# EAGLE design Noise-Source-Stereo (EAGLE 7.2.0)
Random Number Generation with a Simple Transistor Junction Noise Source (Version 1 Revision 2. 22 June 2004) https://imotp.sourceforge.net/noise.pdf
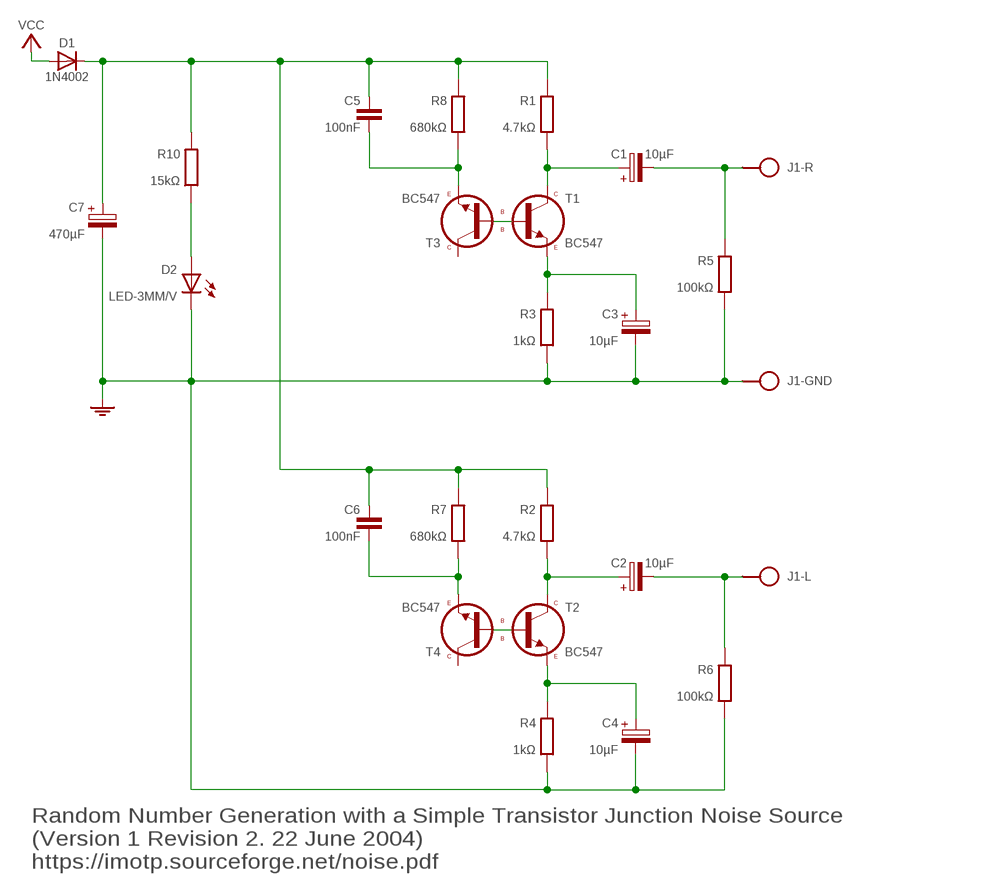
[diagram p0: schematic, sheet 1]

## Parts
C1  10µF  CPOL-HE2,5-5  [E2,5-5]
C2  10µF  CPOL-HE2,5-5  [E2,5-5]
C3  10µF  CPOLE2,5-4/V  [E2.5-4/V]
C4  10µF  CPOLE2,5-4/V  [E2.5-4/V]
C5  100nF  C050-025X075/V  [C050-025X075/V]
C6  100nF  C050-025X075/V  [C050-025X075/V]
C7  470µF  CPOLE5-5/V  [E5-5/V]
D1  1N4002  DIODE-HDO34-7  [DO34-7]
D2  LED-3MM/V  [LED_3MM/V]
GND  VCC_GNDL  [SPAD-+]
J1  SAUDIOR-GND-L  [SPAD-R-GND-L]
R1  4.7kΩ  R0204/10-V  [0204/10-V]
R2  4.7kΩ  R0204/10-V  [0204/10-V]
R3  1kΩ  R0204/10-V  [0204/10-V]
R4  1kΩ  R0204/10  [0204/10]
R5  100kΩ  R0204/10-V  [0204/10-V]
R6  100kΩ  R0204/10-V  [0204/10-V]
R7  680kΩ  R0204/10-V  [0204/10-V]
R8  680kΩ  R0204/10-V  [0204/10-V]
R10  15kΩ  R0204/10-V  [0204/10-V]
T1  BC547  [TO92]
T2  BC547  [TO92]
T3  BC547  [TO92]
T4  BC547  [TO92]

## Nets
GND: C3.- C4.- C7.- D2.K(C) GND.1 J1.0 R3.2 R4.2 R5.2 R6.2
N$1: C2.+ R2.2 T2.1(C)
N$2: C4.+ R4.1 T2.3(E)
N$4: C3.+ R3.1 T1.3(E)
N$6: C1.+ R1.2 T1.1(C)
N$7: T1.2(B) T3.2(B)
N$8: C5.2 R8.2 T3.3(E)
N$9: T2.2(B) T4.2(B)
N$10: D2.A R10.2
N$11: C6.2 R7.2 T4.3(E)
N$12: C2.- J1.L R6.1
N$15: C1.- J1.R R5.1
VCC: D1.A GND.2
VCC2: C5.1 C6.1 C7.+ D1.C R1.1 R2.1 R7.1 R8.1 R10.1
Unconnected: T3.1(C) T4.1(C)

## Notes on the sheet
- Random Number Generation with a Simple Transistor Junction Noise Source
  (Version 1 Revision 2. 22 June 2004)
  https://imotp.sourceforge.net/noise.pdf

## Library data of the parts
C1 C2 = c:CPOL-H
C3 C4 C7 = c:CPOL: POLARIZED CAPACITOR, European symbol
C5 C6 = c:C: CAPACITOR, European symbol
D1 = d:DIODE-H
D2 = d:LED
GND = pad:VCC_GND
J1 = pad:SAUDIO
R1-R8 R10 = r:R: RESISTOR, European symbol
T1-T4 = t:BC547

## Net classes
0 default: clearance 0.254 mm

## Board
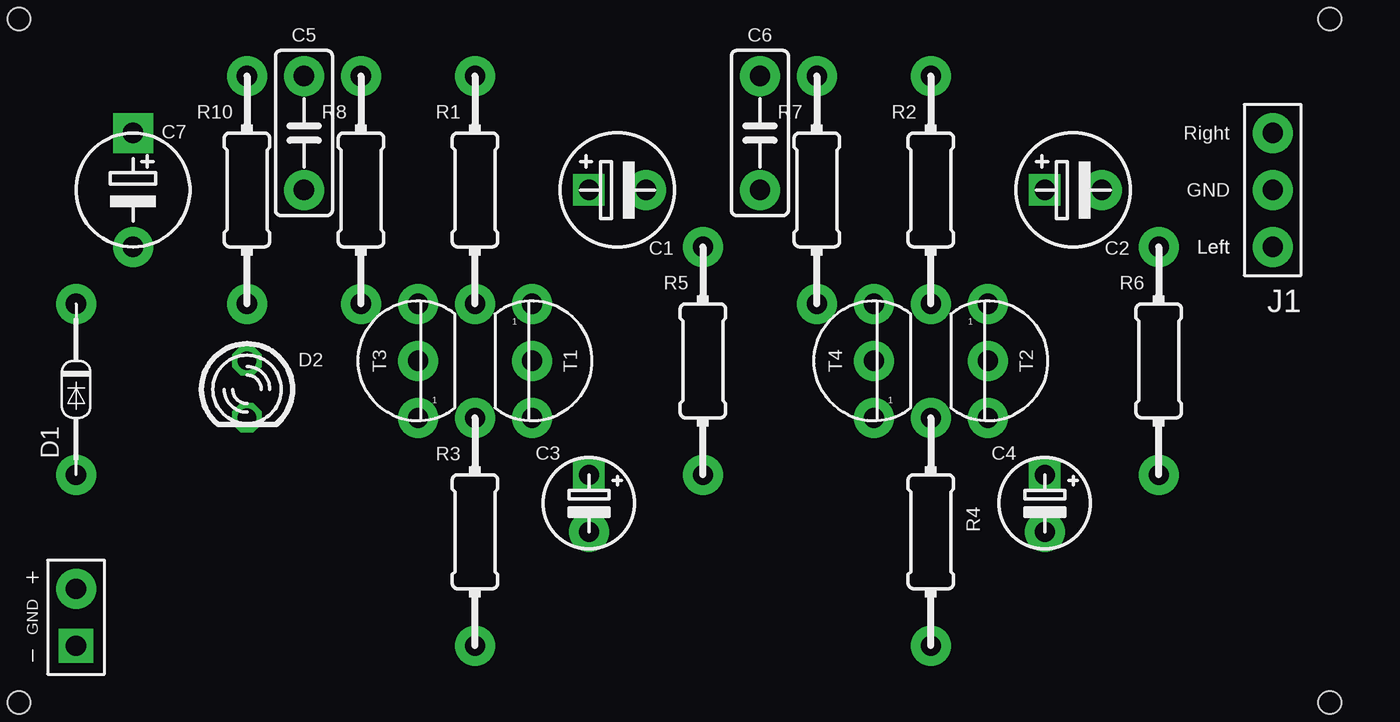
[diagram p1: board, top side]
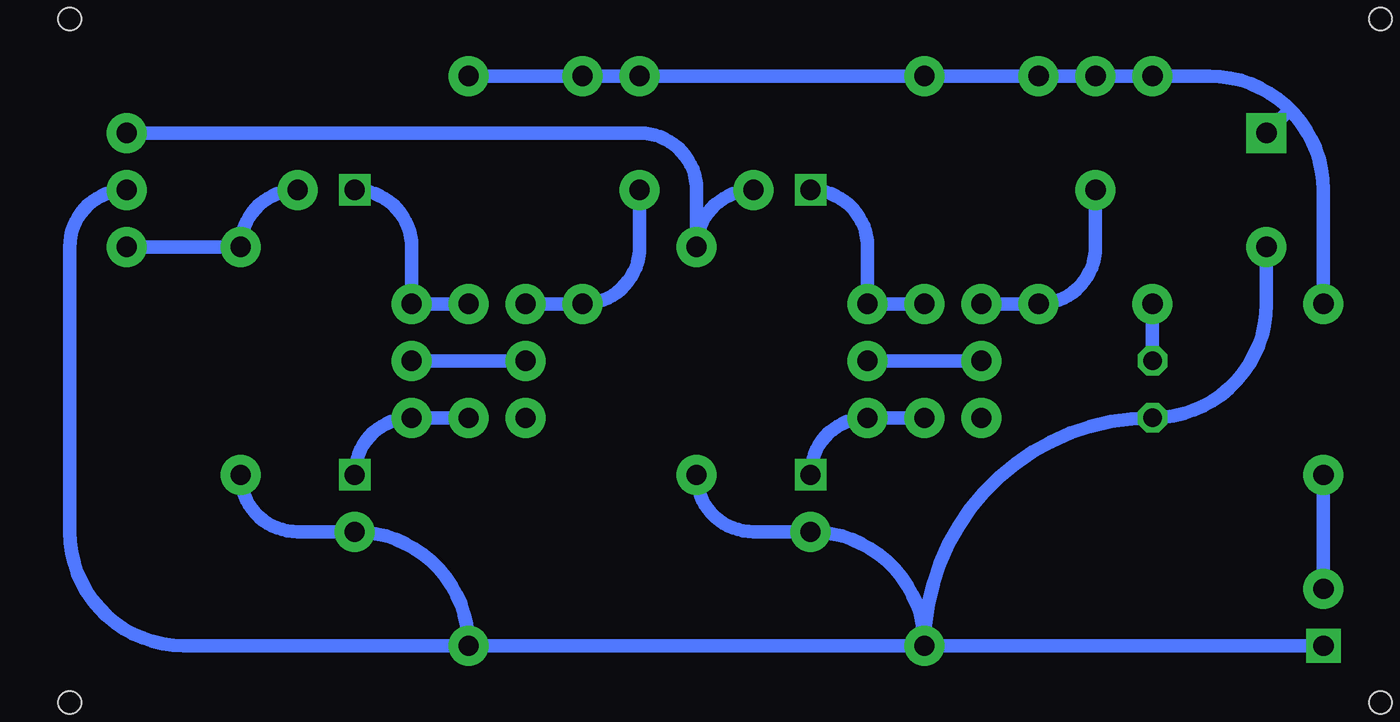
[diagram p2: board, bottom side, seen from below]

No outline drawn. Coordinates in mm, seen from the top.
Copper layers (1*16): Top 0.035mm / dielectric 1.5mm / Bottom 0.035mm
Design rules "default": minimum track width 10mil, minimum drill 24mil, track to track 8mil, track to pad 8mil, pad to pad 8mil, via to via 8mil, smd to smd 8mil, copper to edge 40mil, drill to drill 8mil, minimum pad ring 10mil, minimum via ring 8mil, stop-mask expansion 4mil, vias tented up to drill 0mil, thermal gap 10mil
Holes 1 mm at 5.08,2.54 5.08,33.02 63.5,33.02 63.5,2.54

### Footprints (pad centres in the part's own frame; a part is rotated, then mirrored left to right if it is on the bottom)
E2,5-5 = drill 0.9 square: + 1.27,0 | drill 0.9 pad 1.778: - -1.27,0
E2.5-4/V = drill 0.9 square: + 0,1.27 | drill 0.9 pad 1.778: - 0,-1.27
C050-025X075/V = drill 0.9 pad 1.778: 1 0,2.54; 2 0,-2.54
E5-5/V = drill 0.9 pad 1.778 square: + 0,2.54 | drill 0.9 pad 1.778: - 0,-2.54
DO34-7 = drill 0.9 pad 1.778: A 3.81,0; C -3.81,0
LED_3MM/V = drill 0.813 pad 1.27 octagon: A 0,1.27; K 0,-1.27
SPAD-+ = drill 0.9 pad 1.524 square: 1 0,-1.27 | drill 0.9 pad 1.778: 2 0,1.27
SPAD-R-GND-L = drill 0.9 pad 1.778: 0 0,0; L 0,2.54; R 0,-2.54
0204/10-V = drill 0.9 pad 1.778: 1 0,5.08; 2 0,-5.08
0204/10 = drill 0.9 pad 1.778: 1 -5.08,0; 2 5.08,0
TO92 = drill 0.9 pad 1.778: 1 0,2.54; 2 0,0; 3 0,-2.54

### Placement (x,y rotation side)
C1  31.75,25.4 180 top
C2  52.07,25.4 180 top
C3  30.48,11.43 0 top
C4  50.8,11.43 0 top
C5  17.78,27.94 0 top
C6  38.1,27.94 0 top
C7  10.16,25.4 0 top
D1  7.62,16.51 270 top
D2  15.24,16.51 0 top
GND  7.62,6.35 0 top
J1  60.96,25.4 180 top
R1  25.4,25.4 0 top
R2  45.72,25.4 0 top
R3  25.4,10.16 0 top
R4  45.72,10.16 270 top
R5  35.56,17.78 0 top
R6  55.88,17.78 0 top
R7  40.64,25.4 0 top
R8  20.32,25.4 0 top
R10  15.24,25.4 0 top
T1  27.94,17.78 0 top
T2  48.26,17.78 0 top
T3  22.86,17.78 180 top
T4  43.18,17.78 180 top

### Tracks (layer width: path | path; a pad name or v marks a point on that pad's centre or on a via)
GND
  Bottom 0.61: R3.2 arc-90 C3.- 33.02,10.16 arc90 R5.2 | C7.- 10.16,20.32 arc90 D2.K arc-90 R3.2 | J1.0 arc-90 63.5,22.86 63.5,10.16 arc-90 58.42,5.08 R4.2 | R4.2 R3.2 | R6.2 arc-90 53.34,10.16 C4.- arc90 R4.2 | GND.1 R3.2
N$1
  Bottom 0.61: C2.+ arc90 48.26,22.86 T2.1 R2.2
N$2
  Bottom 0.61: C4.+ arc90 T2.3 R4.1
N$4
  Bottom 0.61: C3.+ arc90 T1.3 R3.1
N$6
  Bottom 0.61: R1.2 T1.1 27.94,22.86 arc-90 C1.+
N$7
  Bottom 0.61: T3.2 T1.2
N$8
  Bottom 0.61: T3.3 R8.2 arc-90 17.78,22.86 C5.2
N$9
  Bottom 0.61: T4.2 T2.2
N$10
  Bottom 0.61: D2.A R10.2
N$11
  Bottom 0.61: C6.2 38.1,22.86 arc90 R7.2 T4.3
N$12
  Bottom 0.61: C2.- arc-90 R6.1 J1.L
N$15
  Bottom 0.61: C1.- arc-90 R5.1 35.56,25.4 arc-90 38.1,27.94 J1.R
VCC
  Bottom 0.61: GND.2 D1.A
VCC2
  Bottom 0.61: R2.1 R7.1 C6.1 R1.1 R8.1 C5.1 R10.1 12.7,30.48 arc90 7.62,25.4 | 7.62,25.4 D1.C | C7.+ 9.14,28.96 arc45 7.62,25.4

### Text on the board
Measures: A | B | C | D | E | F | G | H | I | J | K | L | M | N | O | P | Q | R | S | T | U | V | W | X | 13 | 12 | 11 | 10 | 09 | 08 | 07 | 06 | 05 | 04 | 03 | 02 | 01